# EAGLE design TSOP-II-44 (EAGLE 7.4.0)
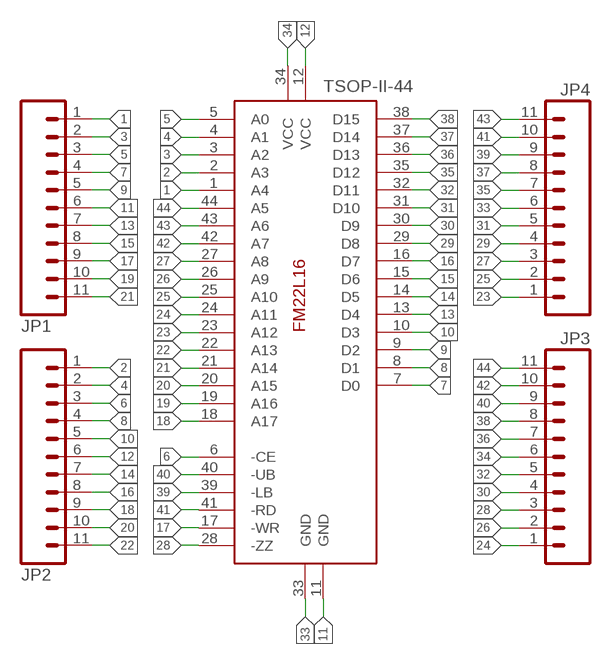
[diagram p0: schematic, sheet 1]

## Parts
JP1  M11PTH  [1X11]
JP2  M11PTH  [1X11]
JP3  M11PTH  [1X11]
JP4  M11PTH  [1X11]
TSOP-II-44  FM22L16-TG  [TSOPII-44]

## Nets
1: JP1.1 TSOP-II-44.1(A4)
2: JP2.1 TSOP-II-44.2(A3)
3: JP1.2 TSOP-II-44.3(A2)
4: JP2.2 TSOP-II-44.4(A1)
5: JP1.3 TSOP-II-44.5(A0)
6: JP2.3 TSOP-II-44.6(-CE)
7: JP1.4 TSOP-II-44.7(D0)
8: JP2.4 TSOP-II-44.8(D1)
9: JP1.5 TSOP-II-44.9(D2)
10: JP2.5 TSOP-II-44.10(D3)
11: JP1.6 TSOP-II-44.11(GND)
12: JP2.6 TSOP-II-44.12(VCC)
13: JP1.7 TSOP-II-44.13(D4)
14: JP2.7 TSOP-II-44.14(D5)
15: JP1.8 TSOP-II-44.15(D6)
16: JP2.8 TSOP-II-44.16(D7)
17: JP1.9 TSOP-II-44.17(-WR)
18: JP2.9 TSOP-II-44.18(A17)
19: JP1.10 TSOP-II-44.19(A16)
20: JP2.10 TSOP-II-44.20(A15)
21: JP1.11 TSOP-II-44.21(A14)
22: JP2.11 TSOP-II-44.22(A13)
23: JP4.1 TSOP-II-44.23(A12)
24: JP3.1 TSOP-II-44.24(A11)
25: JP4.2 TSOP-II-44.25(A10)
26: JP3.2 TSOP-II-44.26(A9)
27: JP4.3 TSOP-II-44.27(A8)
28: JP3.3 TSOP-II-44.28(-ZZ)
29: JP4.4 TSOP-II-44.29(D8)
30: JP3.4 TSOP-II-44.30(D9)
31: JP4.5 TSOP-II-44.31(D10)
32: JP3.5 TSOP-II-44.32(D11)
33: JP4.6 TSOP-II-44.33(GND)
34: JP3.6 TSOP-II-44.34(VCC)
35: JP4.7 TSOP-II-44.35(D12)
36: JP3.7 TSOP-II-44.36(D13)
37: JP4.8 TSOP-II-44.37(D14)
38: JP3.8 TSOP-II-44.38(D15)
39: JP4.9 TSOP-II-44.39(-LB)
40: JP3.9 TSOP-II-44.40(-UB)
41: JP4.10 TSOP-II-44.41(-RD)
42: JP3.10 TSOP-II-44.42(A7)
43: JP4.11 TSOP-II-44.43(A6)
44: JP3.11 TSOP-II-44.44(A5)

## Library data of the parts
JP1-JP4 = SparkFun-Connectors:M11: Header 11 Standard 11-pin 0.1" header. Use with straight break away headers (SKU : PRT-00116), right angle break away headers (PRT-00553), swiss pins (PRT-00743), machine pins (PRT-00117), and female headers (PRT-00115).
TSOP-II-44 = ramtron:FM22L16: NVRAM 256k x 16 or 512k x 8

## Board
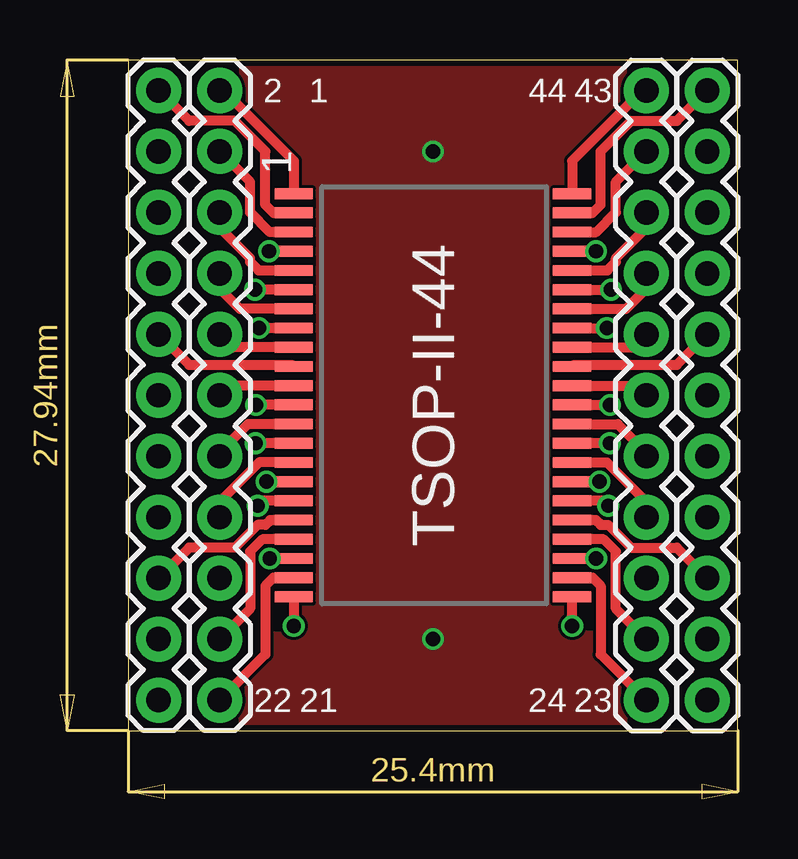
[diagram p1: board, top side]
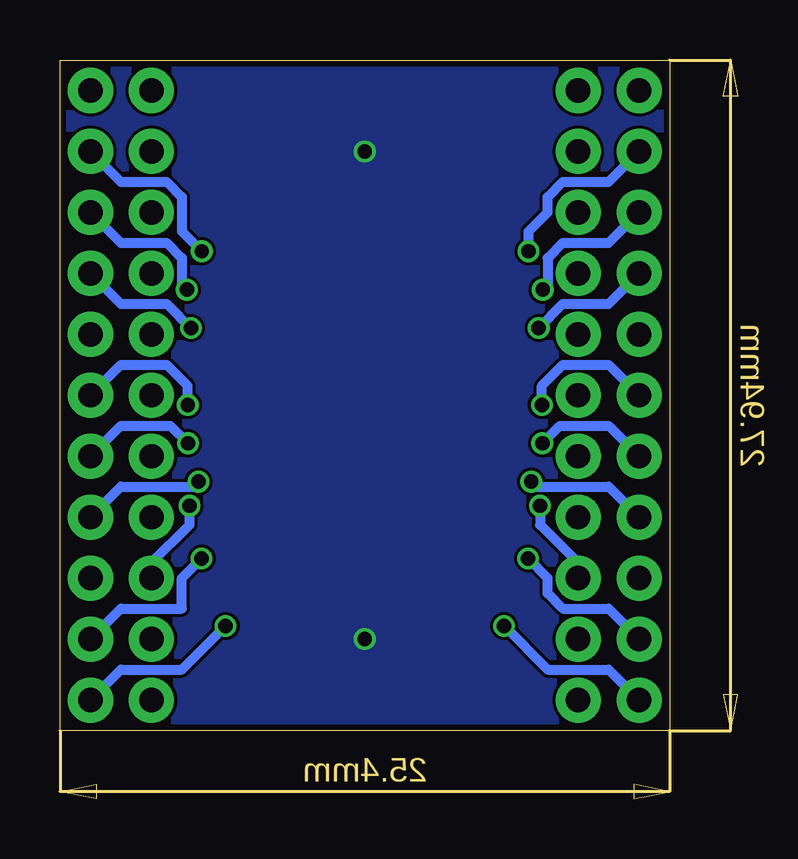
[diagram p2: board, bottom side, seen from below]

Size 25.4 x 27.94 mm. Coordinates in mm from the lower left corner, seen from the top.
Outline: 0,27.94 0,0 25.4,0 25.4,27.94 0,27.94
Copper layers (1*16): Top 0.035mm / dielectric 1.5mm / Bottom 0.035mm
Design rules "dirt_cheap_dirty_boards.v1": minimum track width 5mil, minimum drill 12mil, track to track 5mil, track to pad 5mil, pad to pad 5mil, via to via 5mil, smd to smd 0mil, copper to edge 10mil, drill to drill 10mil, minimum pad ring 10mil, minimum via ring 6mil, stop-mask expansion 2mil, vias tented up to drill 25mil, thermal gap 10mil

### Footprints (pad centres in the part's own frame; a part is rotated, then mirrored left to right if it is on the bottom)
1X11 = drill 1.016 pad 1.88: 1 0,0; 2 2.54,0; 3 5.08,0; 4 7.62,0; 5 10.16,0; 6 12.7,0; 7 15.24,0; 8 17.78,0; 9 20.32,0; 10 22.86,0; 11 25.4,0
TSOPII-44 = smd 0.45 x 1.6: 1 -8.4,-5.8; 2 -7.6,-5.8; 3 -6.8,-5.8; 4 -6,-5.8; 5 -5.2,-5.8; 6 -4.4,-5.8; 7 -3.6,-5.8; 8 -2.8,-5.8; 9 -2,-5.8; 10 -1.2,-5.8; 11 -0.4,-5.8; 12 0.4,-5.8; 13 1.2,-5.8; 14 2,-5.8; 15 2.8,-5.8; 16 3.6,-5.8; 17 4.4,-5.8; 18 5.2,-5.8; 19 6,-5.8; 20 6.8,-5.8; 21 7.6,-5.8; 22 8.4,-5.8; 23 8.4,5.8; 24 7.6,5.8; 25 6.8,5.8; 26 6,5.8; 27 5.2,5.8; 28 4.4,5.8; 29 3.6,5.8; 30 2.8,5.8; 31 2,5.8; 32 1.2,5.8; 33 0.4,5.8; 34 -0.4,5.8; 35 -1.2,5.8; 36 -2,5.8; 37 -2.8,5.8; 38 -3.6,5.8; 39 -4.4,5.8; 40 -5.2,5.8; 41 -6,5.8; 42 -6.8,5.8; 43 -7.6,5.8; 44 -8.4,5.8

### Placement (x,y rotation side)
JP1  3.81,26.67 270 top
JP2  1.27,26.67 270 top
JP3  21.59,1.27 90 top
JP4  24.13,1.27 90 top
TSOP-II-44  12.7,13.97 270 top

### Tracks (layer width: path | path; a pad name or v marks a point on that pad's centre or on a via)
1
  Top 0.406: TSOP-II-44.1 6.9,23.74 3.97,26.67 JP1.1
2
  Top 0.406: TSOP-II-44.2 6.05,21.57 5.71,21.91 5.71,24.13 4.45,25.4 2.54,25.4 JP2.1
3
  Top 0.406: TSOP-II-44.3 5.9,20.77 5.08,21.59 5.08,22.86 JP1.2
4  (via drill 0.6)
  Top 0.406: TSOP-II-44.4 v5.87,19.97
  Bottom 0.406: v5.87,19.97 5.87,20.8 5.08,21.59 5.08,22.23 4.45,22.86 2.54,22.86 JP2.2
5
  Top 0.406: TSOP-II-44.5 5.44,19.17 5.08,19.53 5.08,19.68 3.81,20.95 JP1.3
6  (via drill 0.6)
  Top 0.406: TSOP-II-44.6 v5.28,18.37
  Bottom 0.406: JP2.3 2.54,20.32 4.45,20.32 5.08,19.68 5.08,18.57 v5.28,18.37
7
  Top 0.406: TSOP-II-44.7 4.66,17.57 3.81,18.41 JP1.4
8  (via drill 0.6)
  Top 0.406: TSOP-II-44.8 v5.46,16.77
  Bottom 0.406: v5.46,16.77 4.45,17.78 2.54,17.78 JP2.4
9
  Top 0.406: TSOP-II-44.9 4.35,15.97 JP1.5
10
  Top 0.406: JP2.5 2.54,15.24 6.83,15.24 TSOP-II-44.10
11
  Top 0.406: TSOP-II-44.11 4.21,14.37 JP1.6
12  (via drill 0.6)
  Top 0.406: TSOP-II-44.12 v5.32,13.57
  Bottom 0.406: v5.32,13.57 5.32,14.36 4.45,15.24 2.54,15.24 JP2.6
13
  Top 0.406: TSOP-II-44.13 4.99,12.77 3.81,11.59 JP1.7
14  (via drill 0.6)
  Top 0.406: TSOP-II-44.14 v5.3,11.97
  Bottom 0.406: v5.3,11.97 4.57,12.7 2.54,12.7 JP2.7
15
  Top 0.406: TSOP-II-44.15 5.46,11.17 3.81,9.53 JP1.8
16  (via drill 0.6)
  Top 0.406: TSOP-II-44.16 v5.77,10.37
  Bottom 0.406: v5.77,10.37 5.56,10.16 2.54,10.16 JP2.8
17  (via drill 0.6)
  Top 0.406: TSOP-II-44.17 5.6,9.57 v5.4,9.37
  Bottom 0.406: v5.4,9.37 5.4,8.57 3.81,6.99 JP1.9
18
  Top 0.406: TSOP-II-44.18 5.91,8.77 5.71,8.57 5.4,8.57 4.45,7.62 2.54,7.62 JP2.9
19
  Top 0.406: TSOP-II-44.19 5.59,7.97 5.08,7.46 5.08,5.08 JP1.10
20  (via drill 0.6)
  Top 0.406: TSOP-II-44.20 v5.9,7.17
  Bottom 0.406: JP2.10 2.54,5.08 4.45,5.08 5.08,5.71 5.08,6.35 v5.9,7.17
21
  Top 0.406: TSOP-II-44.21 6.05,6.37 5.71,6.03 5.71,3.17 JP1.11
22  (via drill 0.6)
  Top 0.406: TSOP-II-44.22 v6.9,4.36
  Bottom 0.406: v6.9,4.36 5.08,2.54 2.54,2.54 JP2.11
23  (via drill 0.6)
  Top 0.406: v18.5,4.36 TSOP-II-44.23
  Bottom 0.406: JP4.1 22.86,2.54 20.32,2.54 v18.5,4.36
24
  Top 0.406: TSOP-II-44.24 19.35,6.37 19.68,6.03 19.68,3.17 JP3.1
25  (via drill 0.6)
  Top 0.406: v19.5,7.17 TSOP-II-44.25
  Bottom 0.406: JP4.2 22.86,5.08 20.32,5.08 20.32,6.35 v19.5,7.17
26
  Top 0.406: JP3.2 20.32,5.08 20.32,7.46 19.81,7.97 TSOP-II-44.26
27
  Top 0.406: JP4.3 22.86,7.62 20.95,7.62 20,8.57 19.68,8.57 19.49,8.77 TSOP-II-44.27
28  (via drill 0.6)
  Top 0.406: v20,9.37 19.8,9.57 TSOP-II-44.28
  Bottom 0.406: JP3.3 21.59,6.99 20,8.57 v20,9.37
29  (via drill 0.6)
  Top 0.406: v19.63,10.37 TSOP-II-44.29
  Bottom 0.406: JP4.4 22.86,10.16 19.84,10.16 v19.63,10.37
30
  Top 0.406: TSOP-II-44.30 19.95,11.17 21.59,9.53 JP3.4
31  (via drill 0.6)
  Top 0.406: v20.07,11.97 TSOP-II-44.31
  Bottom 0.406: JP4.5 22.86,12.7 20.8,12.7 v20.07,11.97
32
  Top 0.406: TSOP-II-44.32 20.41,12.77 21.59,11.59 JP3.5
33  (via drill 0.6)
  Top 0.406: TSOP-II-44.33 v20.08,13.57
  Bottom 0.406: JP4.6 22.86,15.24 20.95,15.24 20.08,14.36 v20.08,13.57
34
  Top 0.406: TSOP-II-44.34 21.19,14.37 JP3.6
35
  Top 0.406: TSOP-II-44.35 18.57,15.24 22.86,15.24 JP4.7
36
  Top 0.406: TSOP-II-44.36 21.05,15.97 JP3.7
37  (via drill 0.6)
  Top 0.406: TSOP-II-44.37 v19.95,16.77
  Bottom 0.406: JP4.8 22.86,17.78 20.95,17.78 v19.95,16.77
38
  Top 0.406: TSOP-II-44.38 20.75,17.57 21.59,18.41 JP3.8
39  (via drill 0.6)
  Top 0.406: TSOP-II-44.39 v20.12,18.37
  Bottom 0.406: JP4.9 22.86,20.32 20.95,20.32 20.32,19.68 20.32,18.57 v20.12,18.37
40
  Top 0.406: TSOP-II-44.40 19.96,19.17 20.32,19.53 20.32,19.68 21.59,20.95 JP3.9
41  (via drill 0.6)
  Top 0.406: TSOP-II-44.41 v19.49,19.97
  Bottom 0.406: JP4.10 22.86,22.86 20.95,22.86 20.32,22.23 20.32,20.8 v19.49,19.97
42
  Top 0.406: TSOP-II-44.42 19.5,20.77 20.32,21.59 20.32,22.86 JP3.10
43
  Top 0.406: TSOP-II-44.43 19.35,21.57 19.68,21.91 19.68,24.13 20.95,25.4 22.86,25.4 JP4.11
44
  Top 0.406: JP3.11 21.43,26.67 18.5,23.74 TSOP-II-44.44
GND  (via drill 0.6)
  other vias: 12.7,24.13 12.7,3.81
  pour Bottom: 0,27.94 25.4,27.94 25.4,0 0,0
  pour Top: 0,27.94 25.4,27.94 25.4,0 0,0

### Text on the board
tNames: 2 | 1 | 44 | 43 | 22 | 21 | 24 | 23